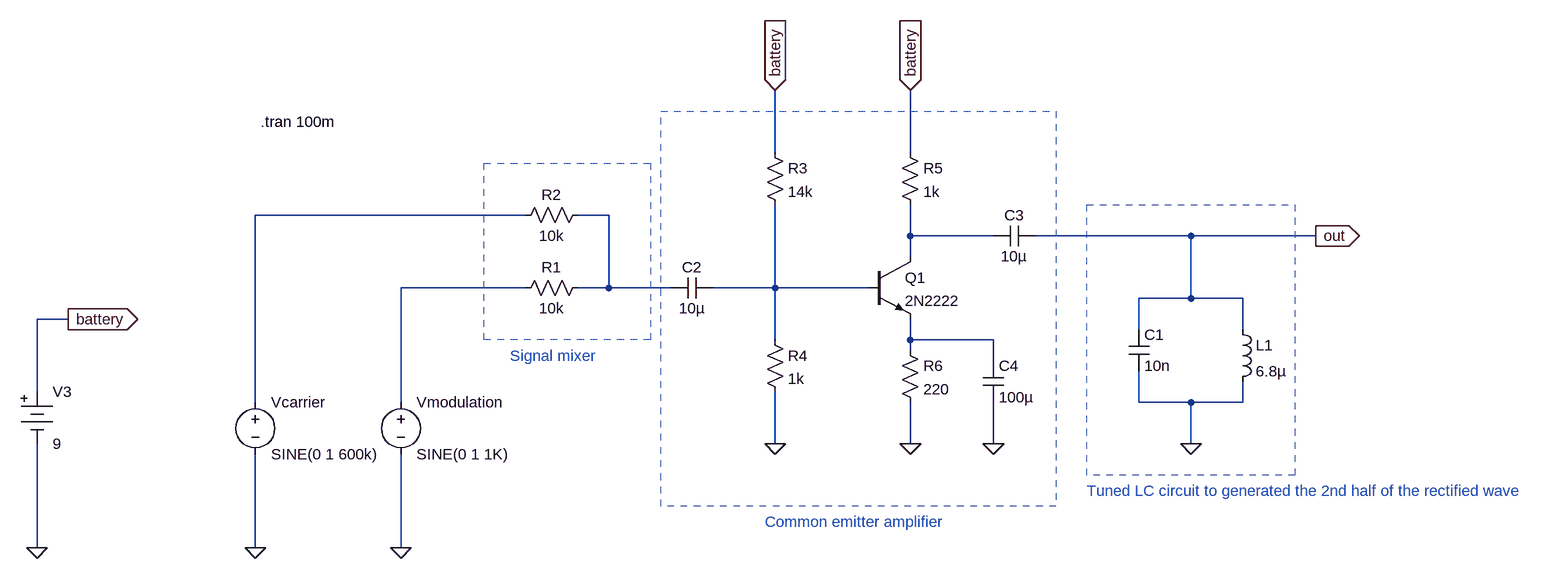
[diagram p0: schematic bjt-am-modulator.asc]
bjt-am-modulator.asc, the LTspice schematic file:
Version 4
SHEET 1 2248 680
WIRE 1024 -288 1024 -384
WIRE 1232 -288 1232 -384
WIRE 640 -192 224 -192
WIRE 768 -192 720 -192
WIRE 1232 -160 1232 -208
WIRE 1360 -160 1232 -160
WIRE 1664 -160 1424 -160
WIRE 1856 -160 1664 -160
WIRE 1232 -128 1232 -160
WIRE 640 -80 448 -80
WIRE 768 -80 768 -192
WIRE 768 -80 720 -80
WIRE 864 -80 768 -80
WIRE 1024 -80 1024 -208
WIRE 1024 -80 928 -80
WIRE 1168 -80 1024 -80
WIRE 1664 -64 1664 -160
WIRE 1664 -64 1584 -64
WIRE 1744 -64 1664 -64
WIRE -64 -32 -112 -32
WIRE 1584 -16 1584 -64
WIRE 1744 -16 1744 -64
WIRE 1024 0 1024 -80
WIRE 1232 0 1232 -32
WIRE 1360 0 1232 0
WIRE 1232 16 1232 0
WIRE 1360 32 1360 0
WIRE -112 80 -112 -32
WIRE 224 96 224 -192
WIRE 448 96 448 -80
WIRE 1584 96 1584 48
WIRE 1664 96 1584 96
WIRE 1744 96 1744 64
WIRE 1744 96 1664 96
WIRE 1024 160 1024 80
WIRE 1232 160 1232 96
WIRE 1360 160 1360 96
WIRE 1664 160 1664 96
WIRE -112 320 -112 160
WIRE 224 320 224 176
WIRE 448 320 448 176
FLAG 224 320 0
FLAG 448 320 0
FLAG 1024 160 0
FLAG -112 320 0
FLAG -64 -32 battery
IOPIN -64 -32 Out
FLAG 1024 -384 battery
IOPIN 1024 -384 In
FLAG 1232 160 0
FLAG 1232 -384 battery
IOPIN 1232 -384 In
FLAG 1664 160 0
FLAG 1856 -160 out
IOPIN 1856 -160 Out
FLAG 1360 160 0
SYMBOL voltage 448 80 R0
WINDOW 123 0 0 Left 0
WINDOW 39 0 0 Left 0
SYMATTR InstName Vmodulation
SYMATTR Value SINE(0 1 1K)
SYMBOL voltage 224 80 R0
WINDOW 123 0 0 Left 0
WINDOW 39 0 0 Left 0
SYMATTR InstName Vcarrier
SYMATTR Value SINE(0 1 600k)
SYMBOL res 736 -96 R90
WINDOW 0 0 56 VBottom 2
WINDOW 3 32 56 VTop 2
SYMATTR InstName R1
SYMATTR Value 10k
SYMBOL res 736 -208 R90
WINDOW 0 0 56 VBottom 2
WINDOW 3 32 56 VTop 2
SYMATTR InstName R2
SYMATTR Value 10k
SYMBOL cap 1568 -16 R0
SYMATTR InstName C1
SYMATTR Value 10n
SYMBOL ind 1728 -32 R0
SYMATTR InstName L1
SYMATTR Value 6.8µ
SYMBOL npn 1168 -128 R0
SYMATTR InstName Q1
SYMATTR Value 2N2222
SYMBOL res 1008 -16 R0
SYMATTR InstName R4
SYMATTR Value 1k
SYMBOL res 1008 -304 R0
SYMATTR InstName R3
SYMATTR Value 14k
SYMBOL cap 928 -96 R90
WINDOW 0 0 32 VBottom 2
WINDOW 3 32 32 VTop 2
SYMATTR InstName C2
SYMATTR Value 10µ
SYMBOL Misc\\battery -112 64 R0
WINDOW 123 0 0 Left 0
WINDOW 39 0 0 Left 0
SYMATTR InstName V3
SYMATTR Value 9
SYMBOL res 1216 -304 R0
SYMATTR InstName R5
SYMATTR Value 1k
SYMBOL res 1216 0 R0
SYMATTR InstName R6
SYMATTR Value 220
SYMBOL cap 1424 -176 R90
WINDOW 0 0 32 VBottom 2
WINDOW 3 32 32 VTop 2
SYMATTR InstName C3
SYMATTR Value 10µ
SYMBOL cap 1344 32 R0
SYMATTR InstName C4
SYMATTR Value 100µ
TEXT 232 -336 Left 2 !.tran 100m
TEXT 616 24 Left 2 ;Signal mixer
TEXT 1008 280 Left 2 ;Common emitter amplifier
TEXT 1504 232 Left 2 ;Tuned LC circuit to generated the 2nd half of the rectified wave
RECTANGLE Normal 832 0 576 -272 2
RECTANGLE Normal 1456 256 848 -352 2
RECTANGLE Normal 1824 208 1504 -208 2

The netlist it stands for:
* bjt-am-modulator.asc
Vmodulation N004 0 SINE(0 1 1K)
Vcarrier N001 0 SINE(0 1 600k)
R1 N002 N004 10k
R2 N002 N001 10k
C1 out 0 10n
L1 out 0 6.8µ
Q1 N003 N005 N006 0 2N2222
R4 N005 0 1k
R3 battery N005 14k
C2 N005 N002 10µ
V3 battery 0 9
R5 battery N003 1k
R6 N006 0 220
C3 out N003 10µ
C4 N006 0 100µ
.model NPN NPN
.model PNP PNP
.lib standard.bjt
.tran 100m
* Signal mixer
* Common emitter amplifier
* Tuned LC circuit to generated the 2nd half of the rectified wave
.backanno
.end